# Altium schematic sheet Basisstation.SchDoc
size A4
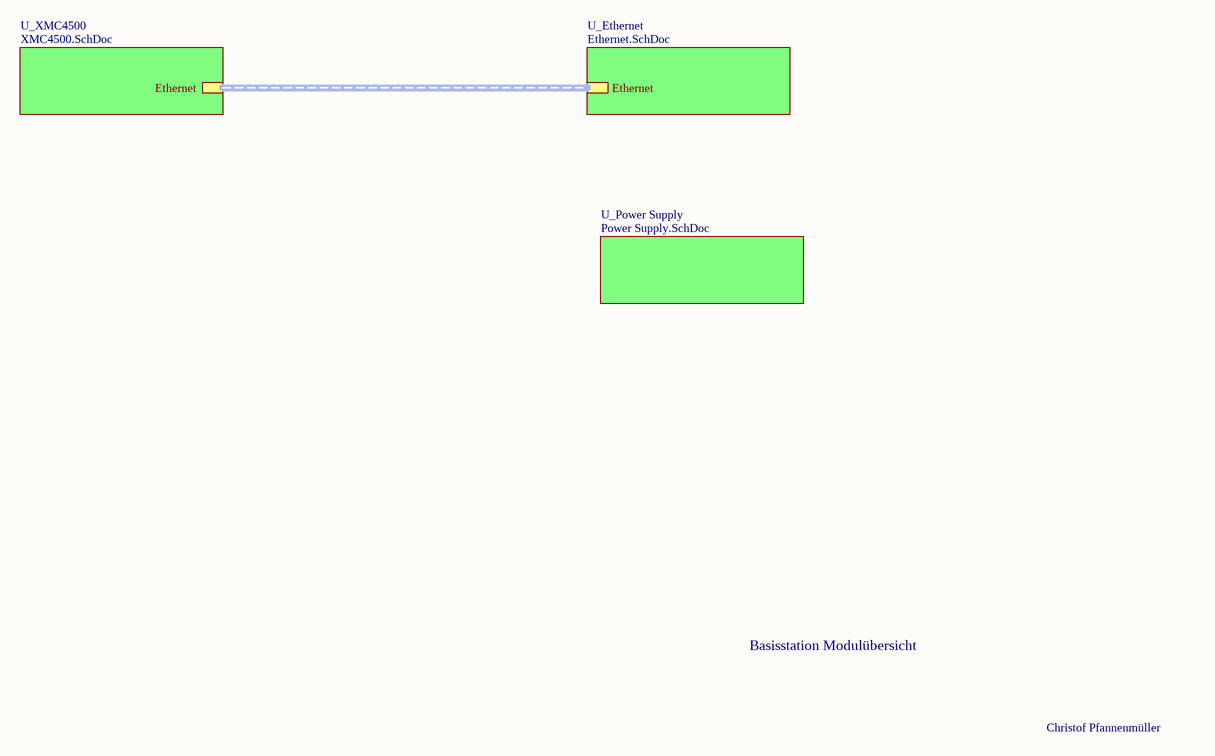
[diagram p0: Basisstation.SchDoc]

## Sub-sheets
U_Ethernet = Ethernet.SchDoc: Ethernet (harness Ethernet)
U_Power Supply = Power Supply.SchDoc: no entries
U_XMC4500 = XMC4500.SchDoc: Ethernet (harness Ethernet)

## Buses and harness runs
harness sheet U_Ethernet/Ethernet = sheet U_XMC4500/Ethernet

## Notes on the sheet
- Basisstation Modulübersicht
- Christof Pfannenmüller